# EAGLE design pic500 (EAGLE 6.4)
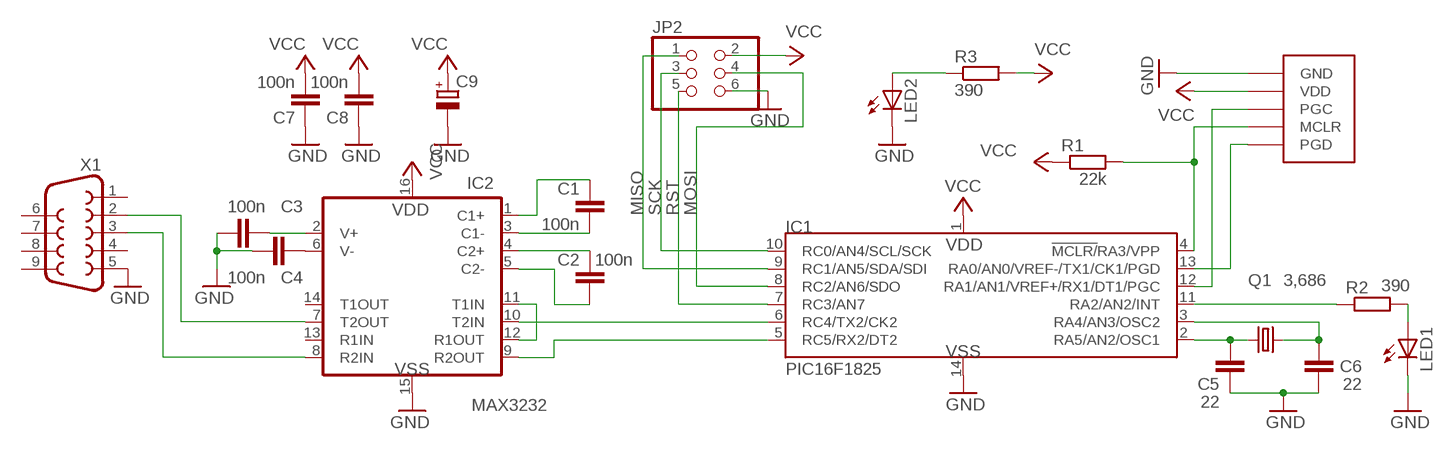
[diagram p0: schematic, sheet 1]

## Parts
C1  100n  C-EU025-025X050  [C025-025X050]
C2  100n  C-EU025-025X050  [C025-025X050]
C3  100n  C-EU025-025X050  [C025-025X050]
C4  100n  C-EU025-025X050  [C025-025X050]
C5  22  C-EU025-025X050  [C025-025X050]
C6  22  C-EU025-025X050  [C025-025X050]
C7  100n  C-EU025-025X050  [C025-025X050]
C8  100n  C-EU025-025X050  [C025-025X050]
C9  CPOL-EUE2-5  [E2-5]
IC1  PIC16F1825  PIC16F1824  [DIL14]
IC2  MAX3232  [DIL16]
JP2  PINHD-2X03_2.54  [2X03]
LED1  LED3MM  [LED3MM]
LED2  LED3MM  [LED3MM]
Q1  3,686  CRYSTALHC49S  [HC49/S]
R1  22k  R-EU_0207/10  [0207/10]
R2  390  R-EU_0207/10  [0207/10]
R3  390  R-EU_0207/10  [0207/10]
U$1  PROGHEAD_254  [PROGHEAD_254]
X1  F09HP  [F09HP]

## Nets
GND: C3.2 C4.2 C5.1 C6.1 C7.1 C8.1 C9.- IC1.14(VSS) IC2.15(VSS) JP2.6 LED1.K(C) LED2.K(C) U$1.GND X1.5
MISO: IC1.9(RC1/AN5/SDA/SDI) JP2.1
MOSI: IC1.8(RC2/AN6/SDO) JP2.4
N$1: IC1.5(RC5/RX2/DT2) IC2.9(R2OUT)
N$2: IC1.6(RC4/TX2/CK2) IC2.10(T2IN)
N$3: IC2.11(T1IN) IC2.12(R1OUT)
N$4: IC2.7(T2OUT) X1.2
N$5: IC2.8(R2IN) X1.3
N$6: C2.2 IC2.5(C2-)
N$7: C2.1 IC2.4(C2+)
N$8: C1.2 IC2.3(C1-)
N$9: C1.1 IC2.1(C1+)
N$10: C3.1 IC2.2(V+)
N$11: C4.1 IC2.6(V-)
N$12: C5.2 IC1.2(RA5/AN2/OSC1) Q1.1
N$13: C6.2 IC1.3(RA4/AN3/OSC2) Q1.2
N$14: LED2.A R3.1
N$15: IC1.13(RA0/AN0/VREF-/TX1/CK1/PGD) U$1.PGD
N$16: IC1.12(RA1/AN1/VREF+/RX1/DT1/PGC) U$1.PGC
N$17: IC1.4(!MCLR/!RA3/VPP) R1.2 U$1.MCLR
N$18: IC1.11(RA2/AN2/INT) R2.1
N$19: LED1.A R2.2
RST: IC1.7(RC3/AN7) JP2.5
SCK: IC1.10(RC0/AN4/SCL/SCK) JP2.3
VCC: C7.2 C8.2 C9.+ IC1.1(VDD) IC2.16(VDD) JP2.2 R1.1 R3.2 U$1.VDD
Unconnected: IC2.13(R1IN) IC2.14(T1OUT) X1.1 X1.4 X1.6 X1.7 X1.8 X1.9

## Library data of the parts
C1-C8 = _rcl:C-EU: CAPACITOR, European symbol
C9 = _rcl:CPOL-EU: POLARIZED CAPACITOR, European symbol
IC1 = _mcom4e:PIC16F1824
IC2 = _mcom4e:MAX3232
JP2 = pinhead-2:PINHD-2X03: PIN HEADER
LED1 LED2 = led:LED: LED OSRAM: - CHIPLED LG R971, LG N971, LY N971, LG Q971, LY Q971, LO R971, LY R971 LH N974, LH R974 LS Q976, LO Q976, LY Q976 LO Q996 - Hyper CHIPLED LW Q18S LB Q993, LB Q99A, LB R99A - SideLED LS A670, LO A670, LY A670, LG A670, LP A670 LB A673, LV A673, LT A673, LW A673 LH A674 LY A675 LS A676, LA A676, LO A676, LY A676, LW A676 LS A679, LY A679, LG A679 - Hyper Micro SIDELED® LS Y876, LA Y876, LO Y876, LY Y876 LT Y87S - SmartLED LW L88C, LW L88S LB L89C, LB L89S, LG L890 LS L89K, LO L89K, LY L89K LS L896, LA L896, LO L896, LY L896 - TOPLED LS T670, LO T670, LY T670, LG T670, LP T670 LSG T670, LSP T670, LSY T670, LOP T670, LYG T670 LG T671, LOG T671, LSG T671 LB T673, LV T673, LT T673, LW T673 LH T674 LS T676, LA T676, LO T676, LY T676, LB T676, LH T676, LSB T676, LW T676 LB T67C, LV T67C, LT T67C, LS T67K, LO T67K, LY T67K, LW E67C LS E67B, LA E67B, LO E67B, LY E67B, LB E67C, LV E67C, LT E67C LW T67C LS T679, LY T679, LG T679 LS T770, LO T770, LY T770, LG T770, LP T770 LB T773, LV T773, LT T773, LW T773 LH T774 LS E675, LA E675, LY E675, LS T675 LS T776, LA T776, LO T776, LY T776, LB T776 LHGB T686 LT T68C, LB T68C - Hyper Mini TOPLED® LB M676 - Mini TOPLED Santana® LG M470 LS M47K, LO M47K, LY M47K Source: http://www.osram.convergy.de LUXEON: - LUMILED® LXK2-PW12-R00, LXK2-PW12-S00, LXK2-PW14-U00, LXK2-PW14-V00 LXK2-PM12-R00, LXK2-PM12-S00, LXK2-PM14-U00 LXK2-PE12-Q00, LXK2-PE12-R00, LXK2-PE12-S00, LXK2-PE14-T00, LXK2-PE14-U00 LXK2-PB12-K00, LXK2-PB12-L00, LXK2-PB12-M00, LXK2-PB14-N00, LXK2-PB14-P00, LXK2-PB14-Q00 LXK2-PR12-L00, LXK2-PR12-M00, LXK2-PR14-Q00, LXK2-PR14-R00 LXK2-PD12-Q00, LXK2-PD12-R00, LXK2-PD12-S00 LXK2-PH12-R00, LXK2-PH12-S00 LXK2-PL12-P00, LXK2-PL12-Q00, LXK2-PL12-R00 Source: www.luxeon.com KINGBRIGHT: KA-3528ASYC Source: www.kingbright.com
Q1 = crystal:CRYSTAL: CRYSTAL
R1-R3 = _rcl:R-EU_: RESISTOR, European symbol
U$1 = _moja:PROGHEAD
X1 = con-subd:F09: SUB-D

## Board
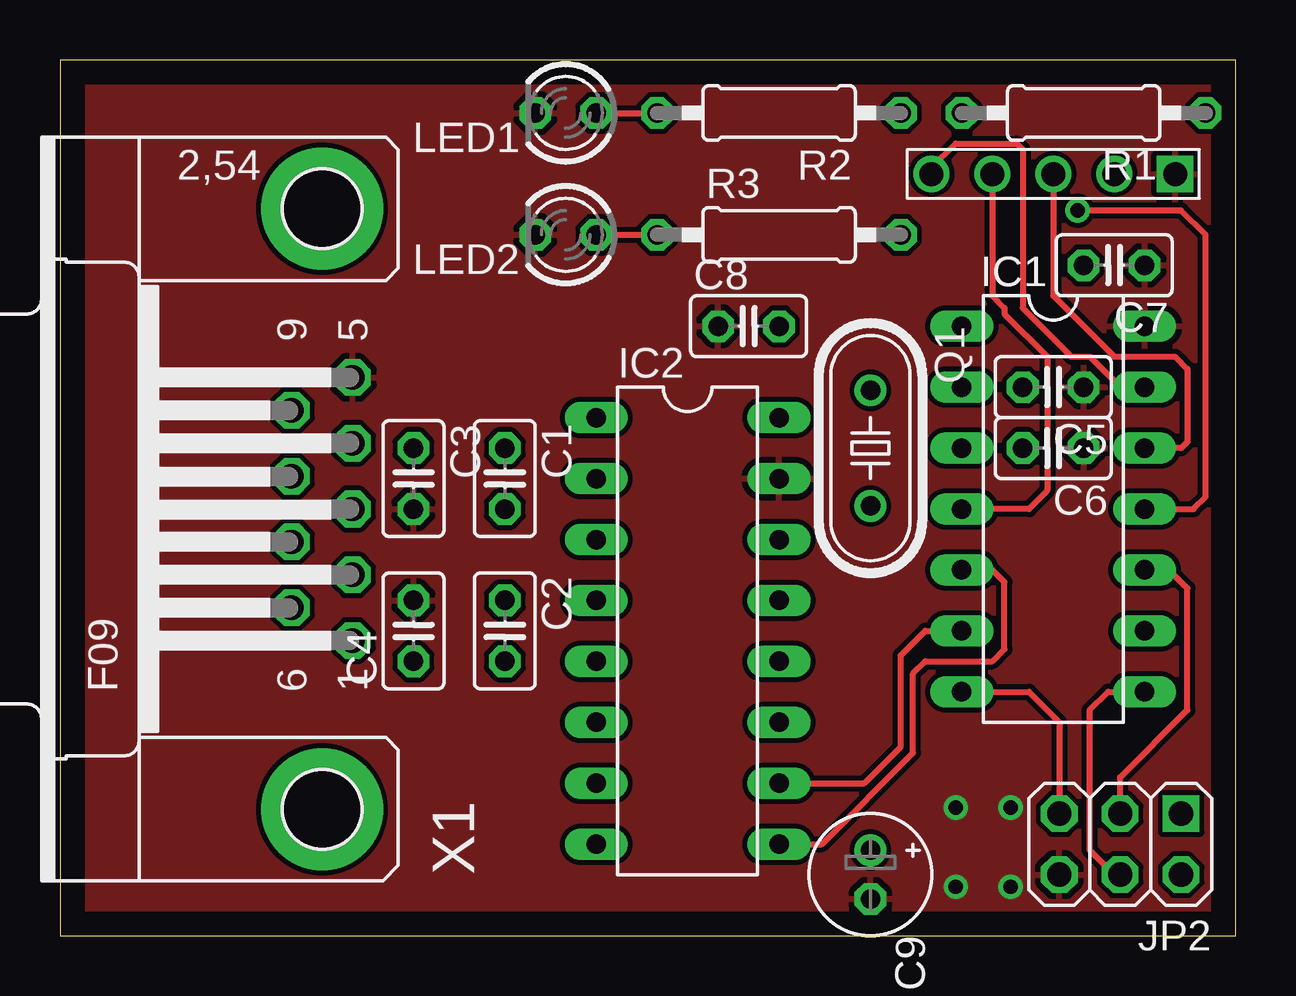
[diagram p1: board, top side]
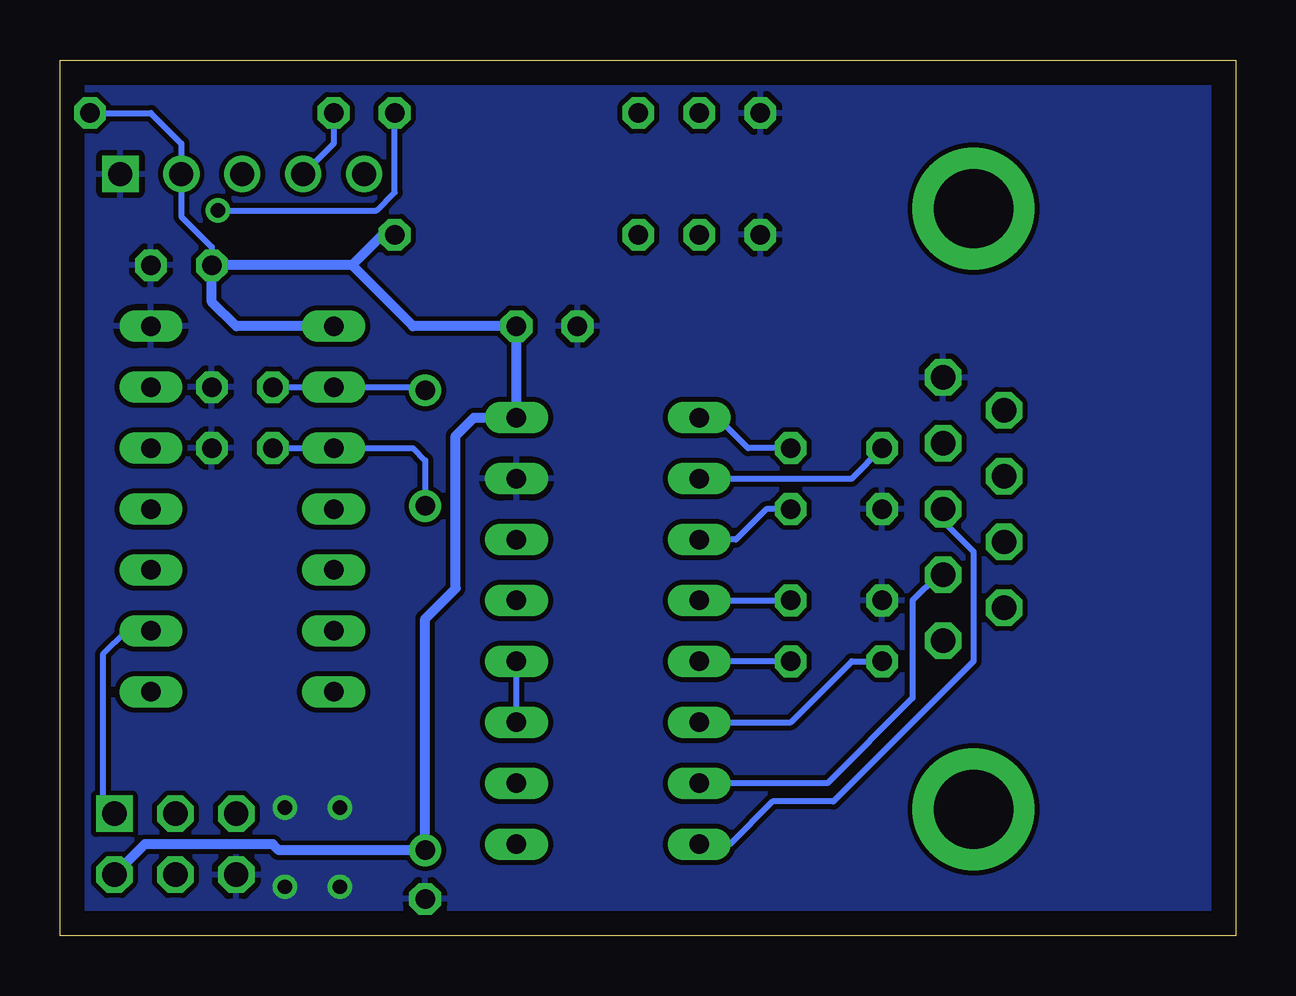
[diagram p2: board, bottom side, seen from below]

Size 49 x 36.5 mm. Coordinates in mm from the lower left corner, seen from the top.
Outline: 0,0 49,0 49,36.5 0,36.5 0,0
Copper layers (1*16): Top 0.035mm / dielectric 1.5mm / Bottom 0.035mm
Design rules "default": minimum track width 10mil, minimum drill 24mil, track to track 8mil, track to pad 8mil, pad to pad 8mil, via to via 8mil, smd to smd 8mil, copper to edge 40mil, drill to drill 8mil, minimum pad ring 10mil, minimum via ring 8mil, stop-mask expansion 4mil, vias tented up to drill 0mil, thermal gap 10mil

### Footprints (pad centres in the part's own frame; a part is rotated, then mirrored left to right if it is on the bottom)
C025-025X050 = drill 0.813 octagon: 1 -1.27,0; 2 1.27,0
E2-5 = drill 0.813 pad 1.27: + -1.016,0 | drill 0.813 pad 1.27 octagon: - 1.016,0
DIL14 = drill 0.813 long: 1 -7.62,-3.81; 2 -5.08,-3.81; 3 -2.54,-3.81; 4 0,-3.81; 5 2.54,-3.81; 6 5.08,-3.81; 7 7.62,-3.81; 8 7.62,3.81; 9 5.08,3.81; 10 2.54,3.81; 11 0,3.81; 12 -2.54,3.81; 13 -5.08,3.81; 14 -7.62,3.81
DIL16 = drill 0.813 long: 1 -8.89,-3.81; 2 -6.35,-3.81; 3 -3.81,-3.81; 4 -1.27,-3.81; 5 1.27,-3.81; 6 3.81,-3.81; 7 6.35,-3.81; 8 8.89,-3.81; 9 8.89,3.81; 10 6.35,3.81; 11 3.81,3.81; 12 1.27,3.81; 13 -1.27,3.81; 14 -3.81,3.81; 15 -6.35,3.81; 16 -8.89,3.81
2X03 = drill 1.016 square: 1 -2.54,-1.27 | drill 1.016 octagon: 2 -2.54,1.27; 3 0,-1.27; 4 0,1.27; 5 2.54,-1.27; 6 2.54,1.27
LED3MM = drill 0.813 octagon: A -1.27,0; K 1.27,0
HC49/S = drill 0.813: 1 -2.413,0; 2 2.413,0
0207/10 = drill 0.813 octagon: 1 -5.08,0; 2 5.08,0
PROGHEAD_254 = drill 1 square: GND -5.08,0 | drill 1: MCLR 2.54,0; PGC 0,0; PGD 5.08,0; VDD -2.54,0
F09HP = drill 1.016 octagon: 1 -5.486,-1.27; 2 -2.743,-1.27; 3 0,-1.27; 4 2.743,-1.27; 5 5.486,-1.27; 6 -4.115,1.27; 7 -1.372,1.27; 8 1.372,1.27; 9 4.115,1.27 | drill 3.302 pad 5.08: G1 -12.522,0; G2 12.522,0

### Placement (x,y rotation side)
C1  18.54,19.05 270 top
C2  18.54,12.7 270 top
C3  14.73,19.05 270 top
C4  14.73,12.7 90 top
C5  41.4,22.86 180 top
C6  41.4,20.32 180 top
C7  43.94,27.94 180 top
C8  28.7,25.4 0 top
C9  33.78,2.54 270 top
IC1  41.4,17.78 270 top
IC2  26.16,12.7 270 top
JP2  44.2,3.81 180 top
LED1  21.08,34.29 180 top
LED2  21.08,29.21 180 top
Q1  33.78,20.32 270 top
R1  42.67,34.29 180 top
R2  29.97,34.29 180 top
R3  29.97,29.21 0 top
U$1  41.4,31.75 180 top
X1  10.92,17.78 90 top

### Tracks (layer width: path | path; a pad name or v marks a point on that pad's centre or on a via)
GND  (via drill 0.6)
  other vias: 37.34,5.33 39.62,5.33 37.34,2.03 39.62,2.03
  pour Top: 1.02,-0.25 49.02,0 49.02,36.58 1.02,36.32
  pour Bottom: 1.02,0 49.02,0 49.02,36.58 1.02,36.58
MISO
  Bottom 0.254: IC1.9 46.23,12.7 47.21,11.72 47.21,5.56 JP2.1
MOSI
  Top 0.254: JP2.4 43.94,2.54 42.93,3.56 42.93,9.4 43.69,10.16 IC1.8
N$1
  Top 0.254: IC2.9 31.75,3.81 35.56,7.62 35.56,10.92 36.07,11.43 38.86,11.43 39.37,11.94 39.37,14.73 38.86,15.24 IC1.5
N$2
  Top 0.254: IC2.10 33.53,6.35 35.05,7.87 35.05,11.68 36.07,12.7 IC1.6
N$3
  Bottom 0.254: IC2.11 IC2.12
N$4
  Bottom 0.254: X1.2 12.39,15.04 13.46,13.97 13.46,9.91 17.02,6.35 IC2.7
N$5
  Bottom 0.254: X1.3 12.19,17.27 10.92,16 10.92,11.43 16.76,5.59 19.3,5.59 21.08,3.81 IC2.8
N$6
  Bottom 0.254: C2.2 IC2.5
N$7
  Bottom 0.254: IC2.4 C2.1
N$8
  Bottom 0.254: C1.2 19.56,17.78 20.83,16.51 IC2.3
N$9
  Bottom 0.254: C1.1 20.32,20.32 21.59,21.59 IC2.1
N$10
  Bottom 0.254: IC2.2 16,19.05 C3.1
N$11
  Bottom 0.254: IC2.6 18.54,8.89 16,11.43 C4.1
N$12
  Bottom 0.254: C5.2 IC1.2 33.91,22.86 Q1.1
N$13
  Bottom 0.254: C6.2 IC1.3 34.29,20.32 33.78,19.81 Q1.2
N$14
  Top 0.254: LED2.A R3.1
N$15
  Top 0.254: U$1.PGD 36.32,32 37.34,33.02 39.88,33.02 40.13,32.77 40.13,26.16 42.16,24.13 42.93,24.13 44.2,22.86 IC1.13
N$16
  Top 0.254: U$1.PGC 41.4,26.67 43.94,24.13 46.48,24.13 46.99,23.62 46.99,20.57 46.74,20.32 IC1.12
N$17
  Top 0.254: U$1.MCLR 38.86,26.67 39.37,26.16 39.37,25.91 41.15,24.13 41.15,18.54 40.39,17.78 IC1.4
  Bottom 0.254: R1.2 37.59,33.02 U$1.MCLR
N$18  (via drill 0.6)
  Top 0.254: IC1.11 47.24,17.78 47.75,18.29 47.75,29.21 46.74,30.23 v42.42,30.23
  Bottom 0.254: v42.42,30.23 35.81,30.23 35.05,30.99 R2.1
N$19
  Top 0.254: LED1.A R2.2
RST
  Top 0.254: IC1.7 40.39,10.16 41.66,8.89 JP2.5
SCK
  Top 0.254: IC1.10 46.23,15.24 46.99,14.48 46.99,9.4 44.2,6.6 JP2.3
VCC
  Bottom 0.254: C7.2 42.67,28.7 43.94,29.97 U$1.VDD 43.94,33.02 45.21,34.29 R1.1
  Bottom 0.406: 36.83,27.94 34.29,25.4 C8.2 IC2.16 31.75,21.59 32.51,20.83 32.51,14.48 33.78,13.21 C9.+ 39.88,3.56 40.13,3.81 45.47,3.81 JP2.2 | 36.83,27.94 C7.2 42.67,26.42 41.66,25.4 IC1.1 | R3.2 35.56,29.21 36.83,27.94